# Altium schematic sheet Sh.SchDoc
size A3
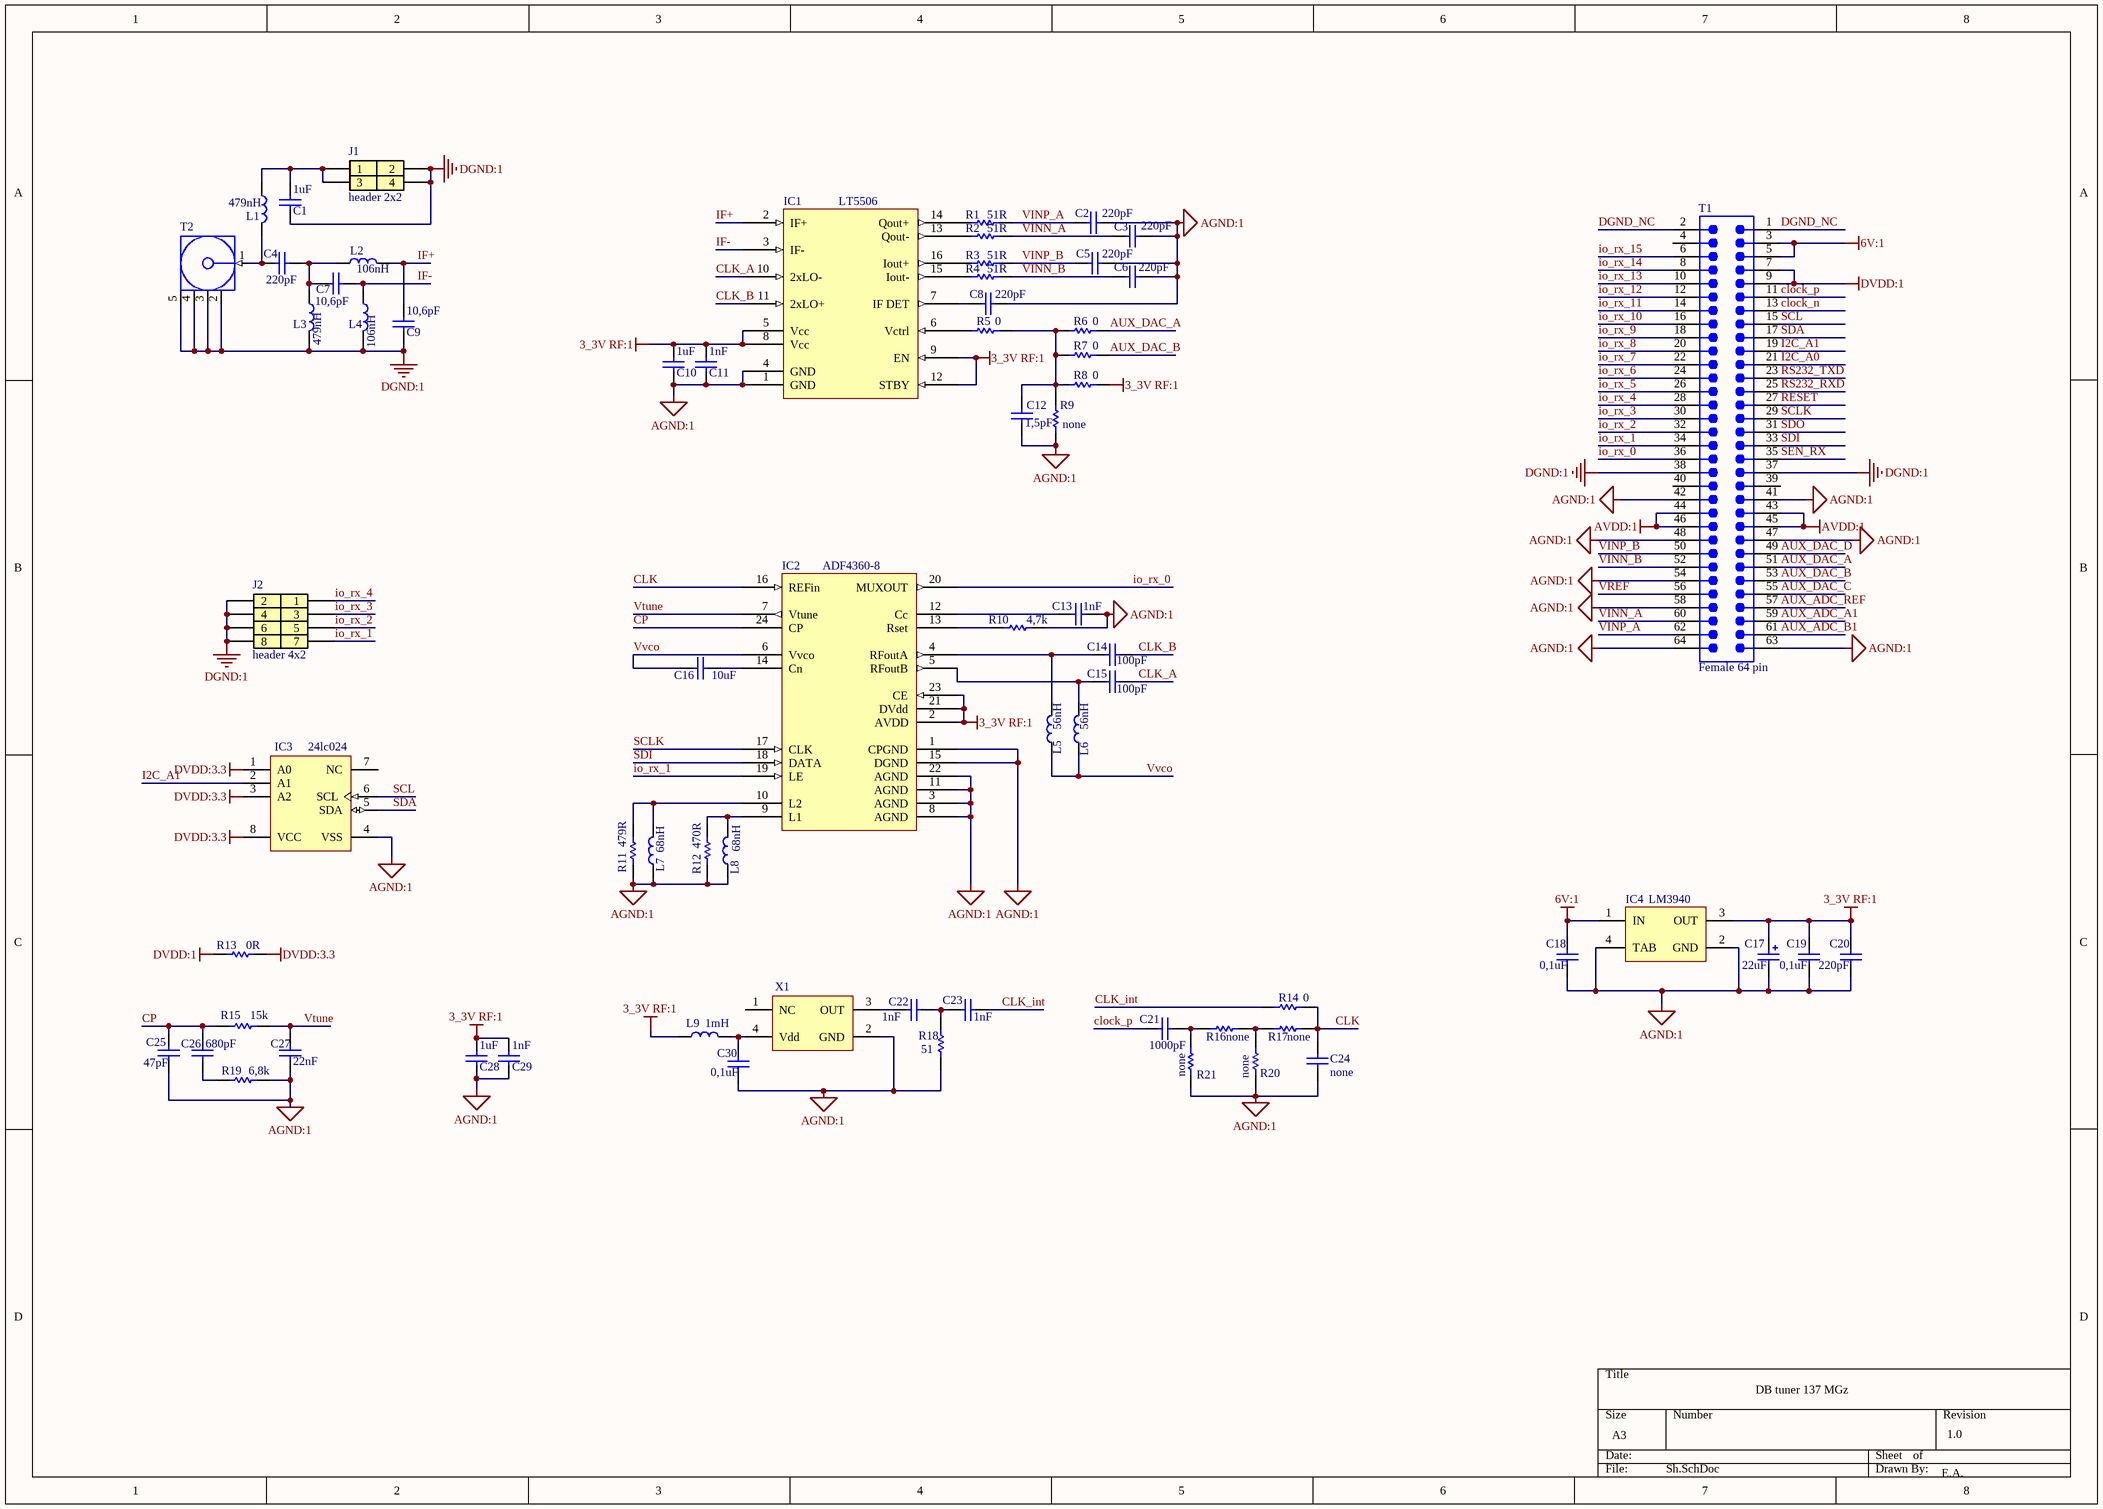
[diagram p0: Sh.SchDoc]

## Parts
C1  1uF  [0805 cap]
C2  220pF  [0805 cap]
C3  220pF  [0805 cap]
C4  220pF  [0805 cap]
C5  220pF  [0805 cap]
C6  220pF  [0805 cap]
C7  10,6pF  [0805 cap]
C8  220pF  [0805 cap]
C9  10,6pF  [0805 cap]
C10  1uF  [0805 cap]
C11  1nF  [0805 cap]
C12  1,5pF  [0805 cap]
C13  1nF  [0805 cap]
C14  100pF  [0805 cap]
C15  100pF  [0805 cap]
C16  10uF  [0805 cap]
C17  22uF  [capacitor C]
C18  0,1uF  [0805 cap]
C19  0,1uF  [0805 cap]
C20  220pF  [0805 cap]
C21  1000pF  [0805 cap]
C22  1nF  [0805 cap]
C23  1nF  [0805 cap]
C24  none  [0805 cap]
C25  47pF  [0805 cap]
C26  680pF  [0805 cap]
C27  22nF  [0805 cap]
C28  1uF  [0805 cap]
C29  1nF  [0805 cap]
C30  0,1uF  [0805 cap]
IC1  LT5506  [QFN65P400X400X80-16N]
IC2  ADF4360-8  [QFN50P408X408X100-24N]
IC3  24lc024  [SOIC_SN8]
IC4  LM3940  [TO-263]
J1  header 2x2  [pld 2x2]
J2  header 4x2  [H_4x2]
L1  479nH  [inductor 0805]
L2  106nH  [inductor 0805]
L3  479nH  [inductor 0805]
L4  106nH  [inductor 0805]
L5  56nH  [inductor 0805]
L6  56nH  [inductor 0805]
L7  68nH  [inductor 0805]
L8  68nH  [inductor 0805]
L9  1mH  [inductor 0805]
R1  51R  [0805 resistor]
R2  51R  [0805 resistor]
R3  51R  [0805 resistor]
R4  51R  [0805 resistor]
R5  0  [0805 resistor]
R6  0  [0805 resistor]
R7  0  [0805 resistor]
R8  0  [0805 resistor]
R9  none  [0805 resistor]
R10  4,7k  [0805 resistor]
R11  479R  [0805 resistor]
R12  470R  [0805 resistor]
R13  0R  [0805 resistor]
R14  0  [0805 resistor]
R15  15k  [0805 resistor]
R16  none  [0805 resistor]
R17  none  [0805 resistor]
R18  51  [0805 resistor]
R19  6,8k  [0805 resistor]
R20  none  [0805 resistor]
R21  none  [0805 resistor]
T1  Female 64 pin  [64pin female Mezzanine]
T2  mcx_connect  [mcx_ra]  (value not drawn)
X1  vcxo  [CLOCK OSCILLATOR]  (value not drawn)

## Nets
3_3V RF:1: C10.2 C11.2 C17.1 C19.2 C20.2 C28.2 C29.2 IC1.5(Vcc) IC1.8(Vcc) IC1.9(EN) IC1.12(STBY) IC2.2(AVDD) IC2.21(DVdd) IC2.23(CE) IC4.3(OUT) L9.1 R8.2
6V:1: C18.1 IC4.1(IN) T1.3 T1.5
AGND:1: C2.2 C3.2 C5.2 C6.2 C8.2 C10.1 C11.1 C12.1 C13.1 C17.2 C18.2 C19.1 C20.1 C24.1 C25.1 C27.1 C28.1 C29.1 C30.1 IC1.1(GND) IC1.4(GND) IC2.1(CPGND) IC2.3(AGND) IC2.8(AGND) IC2.11(AGND) IC2.15(DGND) IC2.22(AGND) IC3.4(VSS) IC4.2(GND) IC4.4(TAB) L7.1 L8.1 R9.1 R10.2 R11.1 R12.1 R18.1 R19.2 R20.1 R21.1 T1.41 T1.42 T1.47 T1.48 T1.54 T1.58 T1.63 T1.64 X1.2(GND)
AVDD:1: T1.43 T1.44 T1.45 T1.46
DGND:1: C1.1 C9.1 J1.2 J1.4 J2.2 J2.4 J2.6 J2.8 L3.2 L4.2 T1.37 T1.38 T2.2(GND) T2.3(GND) T2.4(GND) T2.5(GND)
DVDD:1: R13.1 T1.7 T1.9
DVDD:3.3: IC3.1(A0) IC3.3(A2) IC3.8(VCC) R13.2
AUX_ADC_A1: T1.59
AUX_ADC_B1: T1.61
AUX_ADC_REF: T1.57
AUX_DAC_A: R6.2 T1.51
AUX_DAC_B: R7.2 T1.53
AUX_DAC_C: T1.55
AUX_DAC_D: T1.49
CLK: C24.2 IC2.16(REFin) R14.2 R17.1
CLK_A: C15.1 IC1.10(2xLO-)
CLK_B: C14.1 IC1.11(2xLO+)
CLK_int: C23.2 R14.1
clock_n: T1.13
clock_p: C21.1 T1.11
CP: C25.2 C26.2 IC2.24(CP) R15.1
DGND_NC: T1.1 T1.2
I2C_A0: T1.21
I2C_A1: IC3.2(A1) T1.19
IF+: C9.2 IC1.2(IF+) L2.2
IF-: C7.2 IC1.3(IF-) L4.1
io_rx_0: IC2.20(MUXOUT) T1.36
io_rx_1: IC2.19(LE) J2.7 T1.34
io_rx_2: J2.5 T1.32
io_rx_3: J2.3 T1.30
io_rx_4: J2.1 T1.28
io_rx_5: T1.26
io_rx_6: T1.24
io_rx_7: T1.22
io_rx_8: T1.20
io_rx_9: T1.18
io_rx_10: T1.16
io_rx_11: T1.14
io_rx_12: T1.12
io_rx_13: T1.10
io_rx_14: T1.8
io_rx_15: T1.6
RESET: T1.27
RS232_RXD: T1.25
RS232_TXD: T1.23
SCL: IC3.6(SCL) T1.15
SCLK: IC2.17(CLK) T1.29
SDA: IC3.5(SDA) T1.17
SDI: IC2.18(DATA) T1.33
SDO: T1.31
SEN_RX: T1.35
VINN_A: C3.1 R2.2 T1.60
VINN_B: C6.1 R4.2 T1.52
VINP_A: C2.1 R1.2 T1.62
VINP_B: C5.1 R3.2 T1.50
VREF: T1.56
Vtune: C27.2 IC2.7(Vtune) R15.2
Vvco: C16.1 IC2.6(Vvco) L5.1 L6.1
NetC1_2: C1.2 J1.1 J1.3 L1.1
NetC4_1: C4.1 L1.2 T2.1(Signal)
NetC4_2: C4.2 C7.1 L2.1 L3.1
NetC8_1: C8.1 IC1.7(IF_DET)
NetC12_2: C12.2 R5.2 R6.1 R7.1 R8.1 R9.2
NetC13_2: C13.2 IC2.12(Cc)
NetC14_2: C14.2 IC2.4(RFoutA) L5.2
NetC15_2: C15.2 IC2.5(RFoutB) L6.2
NetC16_2: C16.2 IC2.14(Cn)
NetC21_2: C21.2 R16.1 R21.2
NetC22_1: C22.1 X1.3(OUT)
NetC22_2: C22.2 C23.1 R18.2
NetC26_1: C26.1 R19.1
NetC30_2: C30.2 L9.2 X1.4(Vdd)
NetIC1_6: IC1.6(Vctrl) R5.1
NetIC1_13: IC1.13(Qout-) R2.1
NetIC1_14: IC1.14(Qout+) R1.1
NetIC1_15: IC1.15(Iout-) R4.1
NetIC1_16: IC1.16(Iout+) R3.1
NetIC2_9: IC2.9(L1) L8.2 R12.2
NetIC2_10: IC2.10(L2) L7.2 R11.2
NetIC2_13: IC2.13(Rset) R10.1
NetR16_2: R16.2 R17.2 R20.2

Not connected (* = marked no-connect by the designer): IC3 7(NC); T1 4 39 40; X1 1(NC)

## Notes on the sheet
- DB tuner 137 MGz
- 1.0
- E.A.

## Library data of the parts
C1-C16 C18-C30 = ceramic capacitor
C17 = tantalum capacitor
IC1 = LT5506: 40MHz to 500MHz  Quadrature Demodulator  with VGA
IC2 = ADF4360-8: Integrated Synthesizer and VCO
L1-L9 = inductor
  L4: value: 106nH
R1-R21 = resistor